# Altium schematic sheet Sum.SchDoc
size A4; SheetNumber: 7; SheetTotal: 7
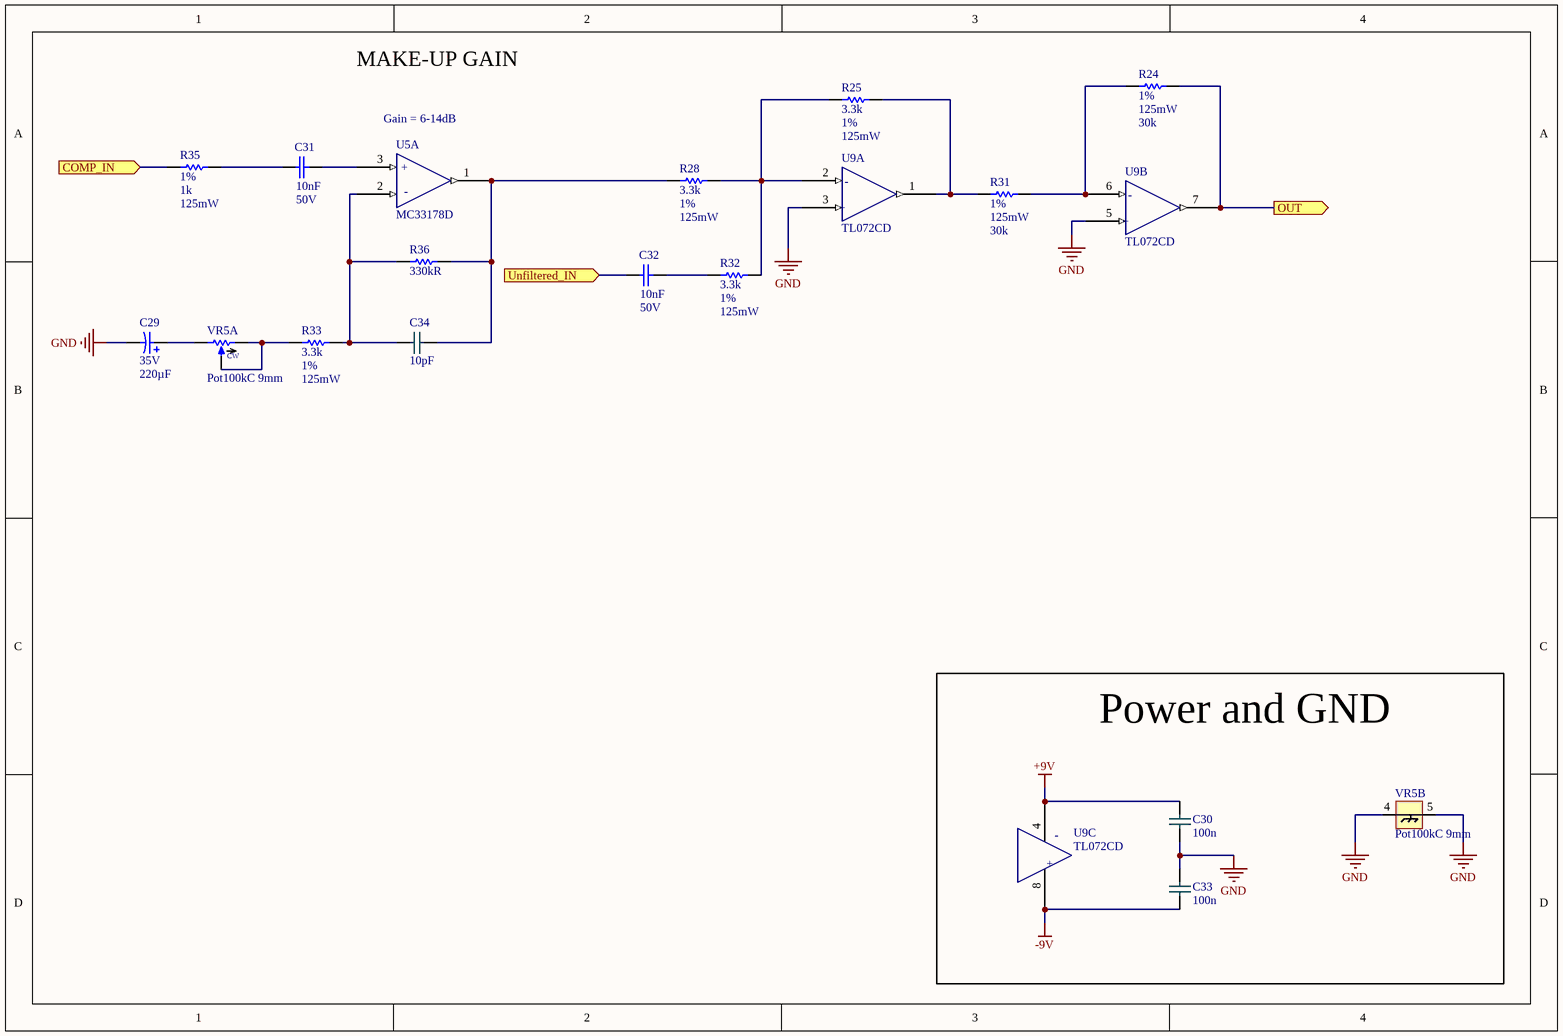
[diagram p0: Sum.SchDoc]

## Parts
C29  Rated Voltage: 35V  Capacitance: 220µF  [E-CAP, SMT, diameter 10mm, height 10.2mm]  (hidden comment: Cap pol 220µF 35V)
C30  value 100n  [0805-CAP]  (hidden comment: Cap 0805 100nF 4)
C31  Capacitance: 10nF  Rated Voltage: 50V  [0805-CAP]  (hidden comment: Cap 10nF 0805 C0G)
C32  Capacitance: 10nF  Rated Voltage: 50V  [0805-CAP]  (hidden comment: Cap 10nF 0805 C0G)
C33  value 100n  [0805-CAP]  (hidden comment: Cap 0805 100nF 4)
C34  Capacitance: 10pF  [0805-CAP]  (hidden comment: cap 0805 10pF)
R24  Tolerance (+-): 1%  Power: 125mW  Resistance: 30k  [0805-RES]  (hidden comment: Res 30k 1% 0805)
R25  Resistance: 3.3k  Tolerance (+-): 1%  Power: 125mW  [0805-RES]  (hidden comment: Res 3.3k 1% 0805)
R28  Resistance: 3.3k  Tolerance (+-): 1%  Power: 125mW  [0805-RES]  (hidden comment: Res 3.3k 1% 0805)
R31  Tolerance (+-): 1%  Power: 125mW  Resistance: 30k  [0805-RES]  (hidden comment: Res 30k 1% 0805)
R32  Resistance: 3.3k  Tolerance (+-): 1%  Power: 125mW  [0805-RES]  (hidden comment: Res 3.3k 1% 0805)
R33  Resistance: 3.3k  Tolerance (+-): 1%  Power: 125mW  [0805-RES]  (hidden comment: Res 3.3k 1% 0805)
R35  Tolerance (+-): 1%  Resistance: 1k  Power: 125mW  [0805-RES]  (hidden comment: Res 1k 1% 0805)
R36  Resistance: 330kR  [0805-RES]  (hidden comment: Res 0805 330k 1%)
U5  MC33178D  [SOIC8-127P600X175-8N]  (part A of 3)
U9  TL072CD  [SOIC8-127P600X175-8N]  (parts A,B,C of 3)
VR5  Pot100kC 9mm  [LJV 9mm pot]  (parts A,B of 2)

## Blocks framed on the sheet
Power and GND: C30 C33 U9 VR5

## Ports
COMP_IN (in), OUT (out), Unfiltered_IN (in)

## Nets
+9V: C30.2 U9.4(V-)
-9V: C33.1 U9.8(V+)
GND: C29.2 C30.1 C33.2 U9.3(IN+) U9.5(IN+) VR5.4 VR5.5
COMP_IN: R35.1 ; port COMP_IN
OUT: R24.2 U9.7 ; port OUT
Unfiltered_IN: C32.1 ; port Unfiltered_IN
NetC29_1: C29.1 VR5.1(CCWPIN)
NetC31_1: C31.1 R35.2
NetC31_2: C31.2 U5.3
NetC32_2: C32.2 R32.1
NetC34_1: C34.1 R33.2 R36.1 U5.2
NetC34_2: C34.2 R28.1 R36.2 U5.1
NetR24_1: R24.1 R31.1 U9.6(IN-)
NetR25_1: R25.1 R28.2 R32.2 U9.2(IN-)
NetR25_2: R25.2 R31.2 U9.1(OUT)
NetR33_1: R33.1 VR5.2(WIPER) VR5.3(CWPIN)

## Notes on the sheet
- MAKE-UP GAIN
- (near U5) Gain = 6-14dB
- (in symbol CMP-028-0012-7, part A) -; +
- (in symbol CMP-028-0012-7, part B) -; +
- (in symbol CMP-028-0012-7, part C) -; +
- (in symbol CMP-028-0053-5, part A) CW
- (in symbol CMP-032-0003-7, part A) +; -

## Library data of the parts
C29 = CMP-00120-4: Cap Aluminum 220uF 35V ±20% (10x10.2mm) SMD 2000h 85°C; Maximum operating temperature: 85°C; Lifetime @ Max. Temp. (hours): 2000h; + Tolerance: 20%; - Tolerance: 20%
C30 C33 = CMP-019-0144-11: 0.1uF 25volts C0G 5%; Source: main.SchLib; PackageDescription: Chip Capacitor; LatestRevisionNote: IPC-7351 Footprint Added.; LatestRevisionDate: 29-May-2009; Publisher: Altium Limited; Published: 8-Jun-2000; Mouser part: 81-GRM31C5C1E104JA01; Design Item ID: Cap 0805 100nF 4; PackageReference: C1206; Fitted: Fitted
C31 C32 = CMP-04096-2: Cap 10nF 0805 C0G 50V +-5%; Tolerance (+-): 5%; Dielectric: C0G; Maximum operating temperature: 125°C; Height: 950µm; Size (Imperial): 0805
C34 = CMP-019-0194-1: Ceramic Capacitor, Multilayer, Ceramic, 25V, 5% +Tol, 5% -Tol, C0G, -/+30ppm/Cel TC, 0.00001uF, Surface Mount, 0805; Manufacturer Series: VJ; Multilayer: Yes; JESD-609 Code: e3; Size Code: 0805; Terminal Finish: Tin; Termination: Wraparound; Negative Tolerance: 5%; Max Operating Temperature: 125°C; RoHS Compliant: Yes; REACH SVHC: Yes; Capacitor Type: Ceramic; Positive Tolerance: 5%; Mount: Surface Mount; Packaging: Tape and Reel; Package Shape: Rectangular; Dielectric Material: Ceramic; Temperature Characteristics Code: C0G; Rated DC Voltage (URdc): 25V; Min Operating Temperature: -55°C; Number of Pins: 2
R24 R31 = CMP-02638-2: Resistor 30k +-1% 0805 Thin film 0.125W +-50ppm/°C; Maximum working voltage: 150V; Temperature Coefficient (ppm/°C): 50; Composition: Thin film; Size (Imperial): 0805
R25 R28 R32 R33 = CMP-02529-2: Resistor 3.3k +-1% 0805 Thin film 0.125W +-50ppm/°C; Maximum working voltage: 150V; Temperature Coefficient (ppm/°C): 50; Composition: Thin film; Size (Imperial): 0805
R35 = CMP-02472-2: Resistor 1k +-1% 0805 Thin film 0.125W +-50ppm/°C; Temperature Coefficient (ppm/°C): 50; Maximum working voltage: 150V; Composition: Thin film; Size (Imperial): 0805
R36 = CMP-037-0126-8: 330kohm, 125mW, 1%, thin film; Temperature Coefficient: 50ppm/°C; Voltage Rating (DC): 150V; Composition: Thin Film; Case/Package: 0805; Case Code (Imperial): 0805; Case Code (Metric): 2012; ComponentLink1Description: https://datasheet.ciiva.com/5990/1392914-5990598.pdf?src-supplier=Farnell; ComponentLink1URL: https://datasheet.ciiva.com/5990/1392914-5990598.pdf?src-supplier=Farnell; ComponentLink2Description: https://datasheet.ciiva.com/5990/1392914-5990601.pdf?src-supplier=Farnell; ComponentLink2URL: https://datasheet.ciiva.com/5990/1392914-5990601.pdf?src-supplier=Farnell; ComponentLink3Description: https://datasheet.ciiva.com/2561/pyu-rt-1-to-0-05-rohs-l-5-2561162.pdf?src-supplier=Digi-Key; ComponentLink3URL: https://datasheet.ciiva.com/2561/pyu-rt-1-to-0-05-rohs-l-5-2561162.pdf?src-supplier=Digi-Key; Contact Plating: Tin; Depth: 1.25mm; Design Item ID: Res 0805 330k 1%; Height: 0.024inch; LatestRevisionDate: 17-Jul-2002; LatestRevisionNote: Re-released for DXP Platform.; Lead Free: Lead Free; Length: 0.079inch; Max Operating Temperature: 125°C; Max Power Dissipation: 125mW; Military Standard: Not; Min Operating Temperature: -55°C; Number of Pins: 2; Number of Terminations: 2; PackageDescription: Axial Device, Thru-Hole; 2 Leads; 0.5 in Pin Spacing; Package Quantity: 5000; PackageReference: AXIAL-0.5; Packaging: Tape and Reel; Power Rating: 125mW; Pricing 1: 1 = 0,10000, 10 = 0,09300, 100 = 0,03580, 1000 = 0,01573, 2500 = 0,01358 (USD); Published: 8-Jun-2000; Publisher: Altium Limited; Radiation Hardening: No; REACH SVHC: No SVHC; RoHS: Yes; Source: main.SchLib; Stock 1: 1168; Termination: SMD/SMT; Tolerance: 1%; Value: 330k; Voltage Rating: 150V; Width: 0.049inch
U5 = CMP-032-0003-7: IC OPAMP GP 5MHZ 8SOIC; Manufacturer: ON Semiconductor; Manufacturer Part Number: MC33178DR2G; Slew Rate: 2V/µs; Max Supply Voltage: 18V; Input Bias Current: 500nA; Number of Elements: 2; Output Current: 80mA; Nominal Supply Current: 900uA; Operating Supply Current: 1.7mA; Min Dual Supply Voltage: 2V; Common Mode Rejection Ratio: 80dB; Max Frequency: 100kHz; Input Offset Voltage (Vos): 3mV; Voltage Gain: 106.02dB; Output Current per Channel: 100mA; ComponentLink3Description: https://datasheet.ciiva.com/1796/mc33178-d-1796436.pdf?src-supplier=Digi-Key; Contact Plating: Tin; Packaging: Tape and Reel; ComponentLink4URL: https://datasheet.ciiva.com/8078/89824-8078566.pdf?src-supplier=Element14; ComponentLink1Description: https://datasheet.ciiva.com/30481/0900766b811a6563-30481352.pdf?src-supplier=RSComponents; Number of Pins: 8; Width: 0.157inch; ComponentLink6URL: https://datasheet.ciiva.com/2973/mc33178-d-2973665.pdf?src-supplier=Avnet; Nominal Gain Bandwidth Product: 5MHz; Min Operating Temperature: -40°C; Design Item ID: MC33178D; Lead Free: Lead Free; Max Dual Supply Voltage: 18V; ComponentLink9Description: https://datasheet.ciiva.com/26056/mc33178-d-26056808.pdf?src-supplier=Avnet+Europe; ComponentLink8URL: https://datasheet.ciiva.com/17068/70275428-17068423.pdf?src-supplier=Allied+Electronics; Length: 0.196inch; Gain Bandwidth Product: 5MHz; ComponentLink9URL: https://datasheet.ciiva.com/26056/mc33178-d-26056808.pdf?src-supplier=Avnet+Europe; Stock 1: 25846; Number of Channels: 2; Number of Amplifiers: 2; ComponentLink6Description: https://datasheet.ciiva.com/2973/mc33178-d-2973665.pdf?src-supplier=Avnet; ComponentLink5URL: https://datasheet.ciiva.com/48491/mc33178-d-48491755.pdf?src-supplier=Avnet; Mouser part: 863-MC33178DG; Case/Package: SOIC; Height: 0.059inch; ComponentLink5Description: https://datasheet.ciiva.com/48491/mc33178-d-48491755.pdf?src-supplier=Avnet; ComponentLink2URL: https://datasheet.ciiva.com/1796/mc33178-d-1796435.pdf?src-supplier=Digi-Key; Radiation Hardening: No; ComponentLink2Description: https://datasheet.ciiva.com/1796/mc33178-d-1796435.pdf?src-supplier=Digi-Key; ComponentLink8Description: https://datasheet.ciiva.com/17068/70275428-17068423.pdf?src-supplier=Allied+Electronics; Package Quantity: 1; ComponentLink1URL: https://datasheet.ciiva.com/30481/0900766b811a6563-30481352.pdf?src-supplier=RSComponents; Halogen Free: Halogen Free; Unity Gain Bandwidth Product: 5MHz; ComponentLink3URL: https://datasheet.ciiva.com/1796/mc33178-d-1796436.pdf?src-supplier=Digi-Key; ComponentLink4Description: https://datasheet.ciiva.com/8078/89824-8078566.pdf?src-supplier=Element14; Max Operating Temperature: 85°C; REACH SVHC: No SVHC; ComponentLink7Description: https://datasheet.ciiva.com/1796/mc33178-d-1796437.pdf?src-supplier=Digi-Key; Pricing 1: 1 = 0.86000, 10 = 0.75300, 100 = 0.57700, 500 = 0.45614, 1000 = 0.36492 (USD); ComponentLink7URL: https://datasheet.ciiva.com/1796/mc33178-d-1796437.pdf?src-supplier=Digi-Key; RoHS: Yes; Source: main.SchLib; Bandwidth: 5MHz; Number of Circuits: 2; Power Supply Rejection Ratio (PSRR): 80dB; PartId: 1
U9 = CMP-028-0012-7: Operational Amplifiers - Op Amps Dual Low Noise JFET SOIC8; Manufacturer 1: Texas Instruments; Operating Supply Voltage: 18V; Number of Elements: 2; Bandwidth: 3MHz; Dual Supply Voltage: 9V; Input Bias Current: 200pA; Min Dual Supply Voltage: 3.5V; Voltage Gain: 106.02dB; Max I/O Voltage: 10mV; Common Mode Rejection Ratio: 70dB; Input Offset Voltage (Vos): 3mV; Slew Rate: 13V/µs; Operating Supply Current: 1.4mA; Nominal Supply Current: 5mA; ComponentLink4URL: http://www.farnell.com/datasheets/1862384.pdf?src-supplier=Element14; ComponentLink4Description: http://www.farnell.com/datasheets/1862384.pdf?src-supplier=Element14; Manufacturer Part Number 1: TL072CD; REACH SVHC: No SVHC; Pricing 1: 1 = 0.71000, 10 = 0.59500, 50 = 0.59500, 100 = 0.38400, 1000 = 0.30700, 10000 = 0.25000 (USD); RoHS: Yes; Source: main.SchLib; ComponentLink1URL: http://www.ti.com/general/docs/lit/getliterature.tsp?genericPartNumber=TL072&&fileType=pdf&src-supplier=Avnet; Height: 1.58mm; Gain Bandwidth Product: 3MHz; ComponentLink5URL: http://focus.ti.com/lit/ds/symlink/tl074.pdf?src-supplier=Avnet+Asia; Number of Amplifiers: 2; ComponentLink2Description: https://www.distrelec.biz/Web/Downloads/_t/ds/tl07x-series_eng_tds.pdf?mime=application%2Fpdf&src-supplier=Distrelec; Radiation Hardening: No; ComponentLink3URL: http://www.ti.com/lit/ds/symlink/tl071a.pdf?src-supplier=Digi-Key; Unity Gain Bandwidth Product: 3MHz; Case/Package: D; Max Operating Temperature: 85°C; Packaging: Rail/Tube; Number of Circuits: 2; Number of Pins: 8; Length: 4.9mm; Number of Channels: 2; Package Quantity: 75; Min Operating Temperature: -40°C; Width: 3.91mm; Lead Free: Lead Free; Stock 1: 14514; ComponentLink3Description: http://www.ti.com/lit/ds/symlink/tl071a.pdf?src-supplier=Digi-Key; Nominal Gain Bandwidth Product: 3MHz; ComponentLink5Description: http://focus.ti.com/lit/ds/symlink/tl074.pdf?src-supplier=Avnet+Asia; Max Dual Supply Voltage: 18V; ComponentLink1Description: http://www.ti.com/general/docs/lit/getliterature.tsp?genericPartNumber=TL072&&fileType=pdf&src-supplier=Avnet; ComponentLink2URL: https://www.distrelec.biz/Web/Downloads/_t/ds/tl07x-series_eng_tds.pdf?mime=application%2Fpdf&src-supplier=Distrelec; Design Item ID: TL072CD
VR5 = CMP-028-0053-5: LJV 9mm pot; Darkglass part: D00-0002; Manufacturer Part Number 1: RP09110NOBA-H02-1485 (C104,KA15A6.5); Value: 100kC; Selective Soldering: YES; SET POSITION: 1; Source: main.SchLib; Design Item ID: Pot100kC 9mm; Supplied by Darkglass: YES